# EAGLE design fm_mod_fpga (EAGLE 7.7.0)
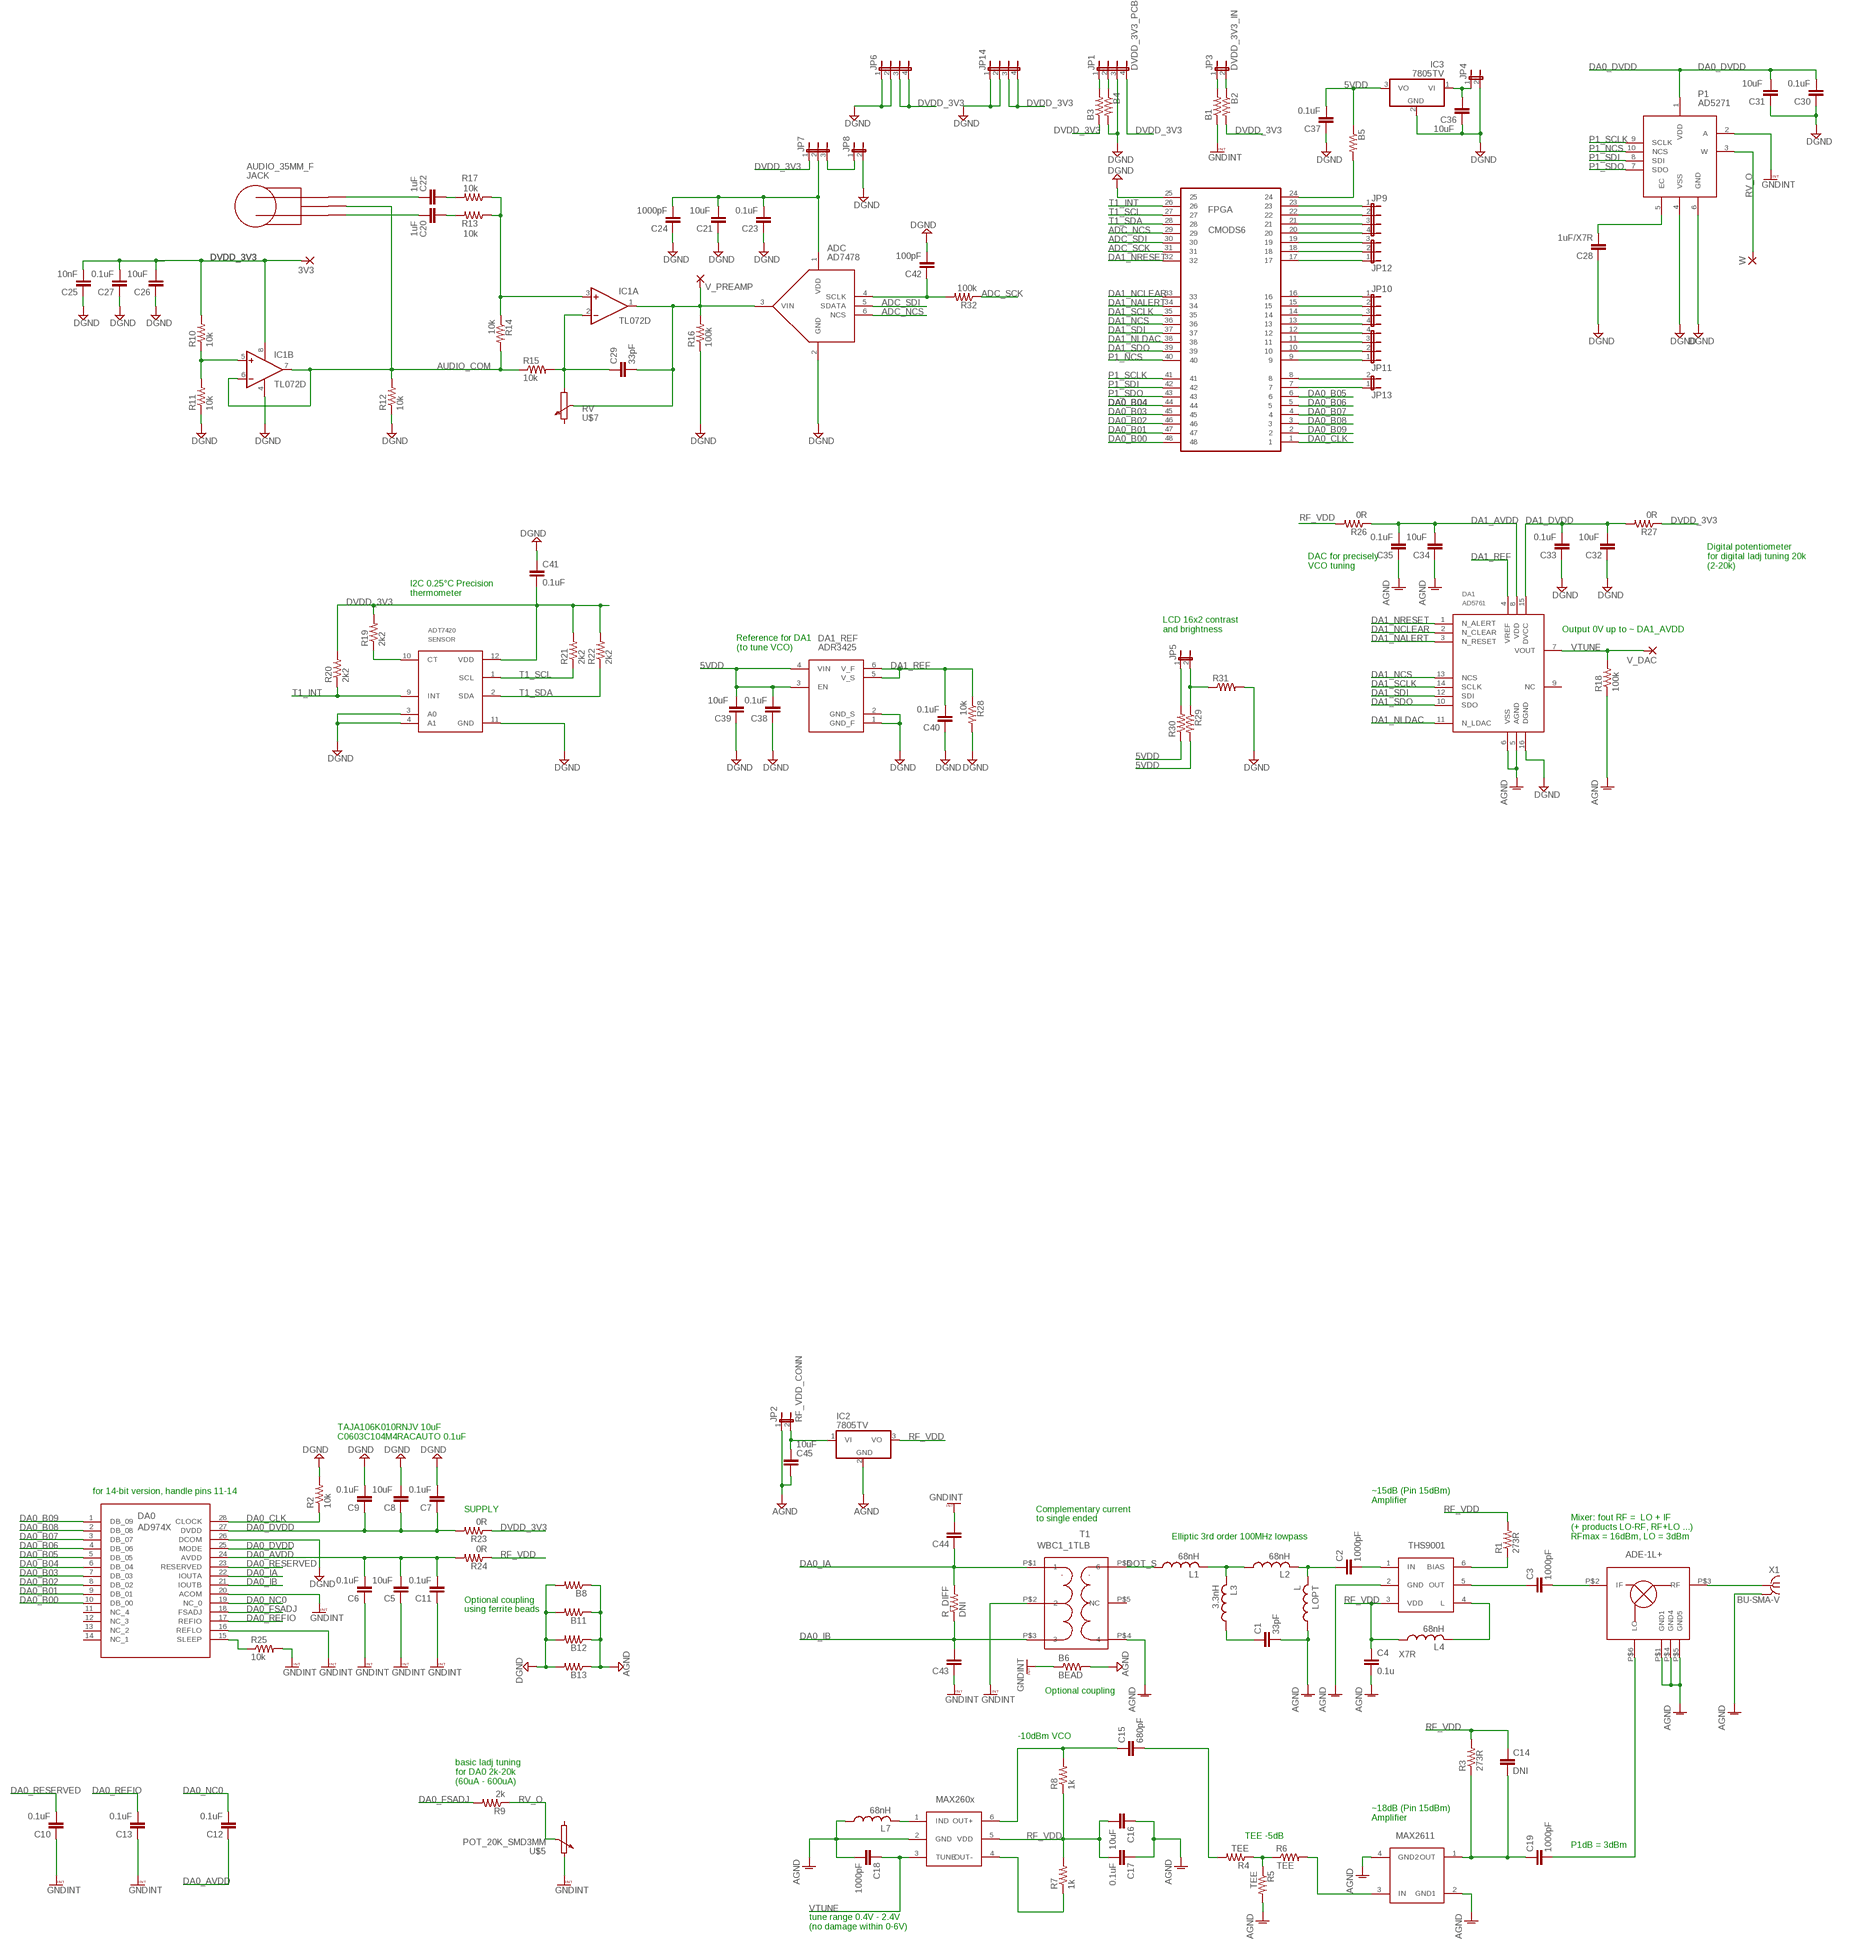
[diagram p0: schematic, sheet 1]

## Parts
3V3  WIREPAD1,6/0,8  [1,6/0,8]
ADC  AD7478  [SOT23-6]
B1  R-US_M0805  [M0805]
B2  R-US_M0805  [M0805]
B3  R-US_M0805  [M0805]
B4  R-US_M0805  [M0805]
B5  R-US_M0805  [M0805]
B6  BEAD  R-US_M0805  [M0805]
B8  R-US_M0805  [M0805]
B11  R-US_M0805  [M0805]
B12  R-US_M0805  [M0805]
B13  R-US_M0805  [M0805]
C1  33pF  C-EUC0603  [C0603]
C2  1000pF  C-EUC0805  [C0805]
C3  1000pF  C-EUC0805  [C0805]
C4  0.1u  C-EUC0805  [C0805]
C5  10uF  C-EUC1206  [C1206]
C6  0.1uF  C-EUC0603  [C0603]
C7  0.1uF  C-EUC0603  [C0603]
C8  10uF  C-EUC1206  [C1206]
C9  0.1uF  C-EUC0603  [C0603]
C10  0.1uF  C-EUC0603  [C0603]
C11  0.1uF  C-EUC0603  [C0603]
C12  0.1uF  C-EUC0603  [C0603]
C13  0.1uF  C-EUC0603  [C0603]
C14  DNI  C-EUC0603  [C0603]
C15  680pF  C-EUC0805  [C0805]
C16  10uF  C-EUC1206  [C1206]
C17  0.1uF  C-EUC0603  [C0603]
C18  1000pF  C-EUC0805  [C0805]
C19  1000pF  C-EUC0805  [C0805]
C20  1uF  C-EUC1206  [C1206]
C21  10uF  C-EUC1206  [C1206]
C22  1uF  C-EUC1206  [C1206]
C23  0.1uF  C-EUC0603  [C0603]
C24  1000pF  C-EUC0805  [C0805]
C25  10nF  C-EUC0805  [C0805]
C26  10uF  C-EUC1206  [C1206]
C27  0.1uF  C-EUC0603  [C0603]
C28  1uF/X7R  C-EUC0805  [C0805]
C29  33pF  C-EUC0603  [C0603]
C30  0.1uF  C-EUC0603  [C0603]
C31  10uF  C-EUC1206  [C1206]
C32  10uF  C-EUC1206  [C1206]
C33  0.1uF  C-EUC0603  [C0603]
C34  10uF  C-EUC1206  [C1206]
C35  0.1uF  C-EUC0603  [C0603]
C36  10uF  C-EUC1206  [C1206]
C37  0.1uF  C-EUC0603  [C0603]
C38  0.1uF  C-EUC0603  [C0603]
C39  10uF  C-EUC1206  [C1206]
C40  0.1uF  C-EUC0603  [C0603]
C41  0.1uF  C-EUC0603  [C0603]
C42  100pF  C-EUC0603  [C0603]
C43  C-EUC0402  [C0402]
C44  C-EUC0402  [C0402]
C45  10uF  C-EUC1206  [C1206]
DA0  AD974X  [TSSOP28]
DA1  AD5761  [TSSOP-16]
DA1_REF  ADR3425  [SOT23-6]
FPGA  CMODS6  [CMODS6_DIP48]
IC1  TL072D  [SO08]
IC2  7805TV  [TO220V]
IC3  7805TV  [TO220V]
JACK  AUDIO_35MM_F  [AUDIO_35MM_F]
JP1  DVDD_3V3_PCB  JP4E  [JP4]
JP2  RF_VDD_CONN  JP1E  [JP1]
JP3  DVDD_3V3_IN  JP1E  [JP1]
JP4  JP1E  [JP1]
JP5  JP1E  [JP1]
JP6  JP4E  [JP4]
JP7  JP2E  [JP2]
JP8  JP1E  [JP1]
JP9  JP4E  [JP4]
JP10  JP4E  [JP4]
JP11  JP4E  [JP4]
JP12  JP2E  [JP2]
JP13  JP1E  [JP1]
JP14  JP4E  [JP4]
L1  68nH  L  [COILCRAFT_0805HP]
L2  68nH  L  [COILCRAFT_0805HP]
L3  3.3nH  L  [COILCRAFT_0805HP]
L4  68nH  L  [COILCRAFT_0805HP]
L7  68nH  L  [COILCRAFT_0805HP]
LOPT  L  [COILCRAFT_0805HP]
P1  AD5271  [MSOP-10]
R1  273R  R-US_R0805  [R0805]
R2  10k  R-US_R0805  [R0805]
R3  273R  R-US_R0805  [R0805]
R4  TEE  R-US_R0805  [R0805]
R5  TEE  R-US_R0805  [R0805]
R6  TEE  R-US_R0805  [R0805]
R7  1k  R-US_R0805  [R0805]
R8  1k  R-US_R0805  [R0805]
R9  2k  R-US_R0805  [R0805]
R10  10k  R-US_R0805  [R0805]
R11  10k  R-US_R0805  [R0805]
R12  10k  R-US_R0805  [R0805]
R13  10k  R-US_R0805  [R0805]
R14  10k  R-US_R0805  [R0805]
R15  10k  R-US_R0805  [R0805]
R16  100k  R-US_R0805  [R0805]
R17  10k  R-US_R0805  [R0805]
R18  100k  R-US_R0805  [R0805]
R19  2k2  R-US_R0805  [R0805]
R20  2k2  R-US_R0805  [R0805]
R21  2k2  R-US_R0805  [R0805]
R22  2k2  R-US_R0805  [R0805]
R23  0R  R-US_R0805  [R0805]
R24  0R  R-US_R0805  [R0805]
R25  10k  R-US_R0805  [R0805]
R26  0R  R-US_R0805  [R0805]
R27  0R  R-US_R0805  [R0805]
R28  10k  R-US_R0805  [R0805]
R29  R-US_R0805  [R0805]
R30  R-US_R0805  [R0805]
R31  R-US_R0805  [R0805]
R32  100k  R-US_R0805  [R0805]
R_DIFF  DNI  R-US_R0603  [R0603]
SENSOR  ADT7420  [LFCSP-16]
T1  WBC1_1TLB  [WBC1_1]
U$2  THS9001  [SOT23-6]
U$3  MAX2611  [SOT143-4]
U$4  MAX260X  [SOT23-6]
U$5  POT_20K_SMD3MM  [POT_3MM_SMD]
U$6  ADE-1L+  [ADE-1L+]
U$7  RV  [RV]
V_DAC  WIREPAD1,6/0,8  [1,6/0,8]
V_PREAMP  WIREPAD1,6/0,8  [1,6/0,8]
W  WIREPAD1,6/0,8  [1,6/0,8]
X1  BU-SMA-V  [BU-SMA-V]

## Nets
5VDD: B5.1 C37.2 C38.2 C39.2 DA1_REF.3(EN) DA1_REF.4(VIN) IC3.3(VO) R29.2 R30.1
100K: ADC.3(VIN) C29.2 IC1.1(A:OUT) R16.2 U$7.2 V_PREAMP.1(P)
ADC_NCS: ADC.6(NCS) FPGA.29
ADC_SCK: FPGA.31 R32.1
ADC_SDI: ADC.5(SDATA) FPGA.30
AGND: B6.2 B8.1 B11.1 B12.1 B13.1 C1.2 C4.2 C16.1 C17.1 C18.2 C34.1 C35.1 C45.2 DA1.5(AGND) DA1.6(VSS) IC2.2(GND) JP2.1 L7.1 LOPT.1 R5.2 R18.1 T1.P$4 U$2.2(GND) U$3.2(GND1) U$3.4(GND2) U$4.2(GND) U$6.P$1(GND1) U$6.P$4(GND4) U$6.P$5(GND5) X1.2 X1.3 X1.4 X1.5
AUDIO_COM: IC1.6(B:-IN) IC1.7(B:OUT) JACK.1 R12.2 R14.2 R15.1
DA0_AVDD: C5.2 C6.2 C11.2 C12.1 DA0.24(AVDD) R24.2
DA0_B00: DA0.10(DB_00) FPGA.48
DA0_B01: DA0.9(DB_01) FPGA.47
DA0_B02: DA0.8(DB_02) FPGA.46
DA0_B03: DA0.7(DB_03) FPGA.45
DA0_B04: DA0.6(DB_04) FPGA.44
DA0_B05: DA0.5(DB_05) FPGA.6
DA0_B06: DA0.4(DB_06) FPGA.5
DA0_B07: DA0.3(DB_07) FPGA.4
DA0_B08: DA0.2(DB_08) FPGA.3
DA0_B09: DA0.1(DB_09) FPGA.2
DA0_CLK: DA0.28(CLOCK) FPGA.1 R2.1
DA0_DVDD: C7.1 C8.1 C9.1 C30.2 C31.2 DA0.25(MODE) DA0.27(DVDD) P1.1(VDD) R23.2
DA0_FSADJ: DA0.18(FSADJ) R9.2
DA0_IA: C44.1 DA0.22(IOUTA) R_DIFF.2 T1.P$1
DA0_IB: C43.2 DA0.21(IOUTB) R_DIFF.1 T1.P$3
DA0_NC0: C12.2 DA0.19(NC_0)
DA0_REFIO: C13.2 DA0.17(REFIO)
DA0_RESERVED: C10.2 DA0.23(RESERVED)
DA0_SLEEP: DA0.15(SLEEP) R25.1
DA1_AVDD: C34.2 C35.2 DA1.8(VDD) R26.1
DA1_DVDD: C32.2 C33.2 DA1.15(DVCC) R27.2
DA1_NALERT: DA1.3(N_RESET) FPGA.34
DA1_NCLEAR: DA1.2(N_CLEAR) FPGA.33
DA1_NCS: DA1.13(NCS) FPGA.36
DA1_NLDAC: DA1.11(N_LDAC) FPGA.38
DA1_NRESET: DA1.1(N_ALERT) FPGA.32
DA1_REF: C40.2 DA1.4(VREF) DA1_REF.5(V_S) DA1_REF.6(V_F) R28.1
DA1_SCLK: DA1.14(SCLK) FPGA.35
DA1_SDI: DA1.12(SDI) FPGA.37
DA1_SDO: DA1.10(SDO) FPGA.39
DGND: ADC.2(GND) B4.2 B8.2 B11.2 B12.2 B13.2 C7.2 C8.2 C9.2 C21.1 C23.1 C24.1 C25.1 C26.1 C27.1 C28.1 C30.1 C31.1 C32.1 C33.1 C36.1 C37.1 C38.1 C39.1 C40.1 C41.1 C42.2 DA0.26(DCOM) DA1.16(DGND) DA1_REF.1(GND_F) DA1_REF.2(GND_S) FPGA.25 IC1.4(P:V-) IC3.2(GND) JP1.3 JP4.2 JP6.1 JP6.2 JP8.2 JP14.1 JP14.2 P1.4(VSS) P1.6(GND) R2.2 R11.1 R12.1 R16.1 R28.2 R31.2 SENSOR.3(A0) SENSOR.4(A1) SENSOR.11(GND)
DOT_S [rf_path]: L1.1 T1.P$6
DVDD_3V3: 3V3.1(P) B2.2 B3.1 C25.2 C26.2 C27.2 C41.2 IC1.8(P:V+) JP1.4 JP6.3 JP6.4 JP7.1 JP14.3 JP14.4 R10.2 R19.2 R20.2 R21.2 R22.2 R23.1 R27.1 SENSOR.12(VDD)
GNDINT: B1.1 B6.1 C5.1 C6.1 C10.1 C11.1 C13.1 C43.1 C44.2 DA0.16(REFLO) DA0.20(ACOM) P1.2(A) R25.2 T1.P$2 U$5.3
N$1 [rf_path]: C15.1 R8.2 U$4.6(OUT+)
N$2 [rf_path]: U$6.P$3(RF) X1.1
N$3: C1.1 L3.1
N$4 [rf_path]: L1.2 L2.1 L3.2
N$5 [rf_path]: C15.2 R4.2
N$6 [rf_path]: C2.1 L2.2 LOPT.2
N$7 [rf_path]: C2.2 U$2.1(IN)
N$8: R1.1 U$2.6(BIAS)
N$9: C3.1 U$2.5(OUT)
N$10: L4.2 U$2.4(L)
N$12: C22.1 JACK.3
N$13 [rf_path]: C14.2 C19.1 R3.1 U$3.1(OUT)
N$14: R7.1 U$4.4(OUT-)
N$17 [rf_path]: R6.2 U$3.3(IN)
N$18 [rf_path]: C19.2 U$6.P$6(LO)
N$19 [rf_path]: R4.1 R5.1 R6.1
N$20: L7.2 U$4.1(IND)
N$21 [rf_path]: C3.2 U$6.P$2(IF)
N$22: B1.2 JP3.1
N$24: ADC.1(VDD) C21.2 C23.2 C24.2 JP7.2
N$25: ADC.4(SCLK) C42.1 R32.2
N$26: JP7.3 JP8.1
N$27: FPGA.8 JP13.2
N$28: B2.1 JP3.2
N$30: B3.2 JP1.1
N$31: B4.1 JP1.2
N$41: IC1.3(A:+IN) R13.1 R14.1 R17.1
N$44: IC1.5(B:+IN) R10.1 R11.2
N$47: C20.2 JACK.2
N$48: C29.1 IC1.2(A:-IN) R15.2 U$7.1
N$49: C22.2 R17.2
N$50: C20.1 R13.2
N$51: FPGA.7 JP13.1
N$52: FPGA.16 JP10.1
N$53: C45.1 IC2.1(VI) JP2.2
N$54: FPGA.15 JP10.2
N$55: FPGA.14 JP10.3
N$56: C28.2 P1.5(EC)
N$57: C36.2 IC3.1(VI) JP4.1
N$58: JP5.1 R30.2
N$59: JP5.2 R29.1 R31.1
N$60: FPGA.13 JP10.4
N$61: R19.1 SENSOR.10(CT)
N$62: FPGA.9 JP11.1
N$63: FPGA.10 JP11.2
N$64: FPGA.23 JP9.1
N$65: FPGA.22 JP9.2
N$66: FPGA.21 JP9.3
N$67: FPGA.20 JP9.4
N$68: FPGA.17 JP12.1
N$69: FPGA.18 JP12.2
N$70: FPGA.19 JP12.3
N$71: FPGA.11 JP11.3
N$72: FPGA.12 JP11.4
N$73: B5.2 FPGA.24
P1_NCS: FPGA.40 P1.10(NCS)
P1_SCLK: FPGA.41 P1.9(SCLK)
P1_SDI: FPGA.42 P1.8(SDI)
P1_SDO: FPGA.43 P1.7(SDO)
RF_VDD: C4.1 C14.1 C16.2 C17.2 IC2.3(VO) L4.1 R1.2 R3.2 R7.2 R8.1 R24.1 R26.2 U$2.3(VDD) U$4.5(VDD)
RV_O: P1.3(W) R9.1 U$5.2 W.1(P)
T1_INT: FPGA.26 R20.1 SENSOR.9(INT)
T1_SCL: FPGA.27 R21.1 SENSOR.1(SCL)
T1_SDA: FPGA.28 R22.1 SENSOR.2(SDA)
VTUNE: C18.1 DA1.7(VOUT) R18.2 U$4.3(TUNE) V_DAC.1(P)
Unconnected: DA0.11(NC_4) DA0.12(NC_3) DA0.13(NC_2) DA0.14(NC_1) DA1.9(NC) T1.P$5(NC) U$5.1 U$7.3

## Notes on the sheet
- DAC for precisely
  VCO tuning
- Digital potentiometer
  for digital Iadj tuning 20k
  (2-20k)
- I2C 0.25°C Precision 
  thermometer
- LCD 16x2 contrast
  and brightness
- Output 0V up to ~ DA1_AVDD
- Reference for DA1
  (to tune VCO)
- TAJA106K010RNJV 10uF
  C0603C104M4RACAUTO 0.1uF
- for 14-bit version, handle pins 11-14
- ~15dB (Pin 15dBm)
  Amplifier
- SUPPLY | Complementary current
- to single ended
- Elliptic 3rd order 100MHz lowpass
- Mixer: fout RF =  LO + IF
  (+ products LO-RF, RF+LO ...)
  RFmax = 16dBm, LO = 3dBm
- Optional coupling
- using ferrite beads
- X7R
- Optional coupling
- -10dBm VCO
- basic Iadj tuning
  for DA0 2k-20k
  (60uA - 600uA)
- ~18dB (Pin 15dBm)
  Amplifier
- TEE -5dB
- P1dB = 3dBm
- tune range 0.4V - 2.4V
  (no damage within 0-6V)

## Library data of the parts
3V3 V_DAC V_PREAMP W = wirepad:WIREPAD: Wire PAD connect wire on PCB
ADC = FM_transmitter:AD7478
B1-B6 B8 B11-B13 R1-R32 = resistor:R-US_: RESISTOR, American symbol
C1-C45 = resistor:C-EU: CAPACITOR, European symbol
DA0 = FM_transmitter:AD974X
DA1 = FM_transmitter:AD5761
DA1_REF = FM_transmitter:ADR3425
FPGA = FM_transmitter:CMODS6
IC1 = linear:TL072: OP AMP
IC2 IC3 = linear:78*: Positive VOLTAGE REGULATOR Source: http://cache.national.com/ds/LM/LM78L05.pdf http://www.fairchildsemi.com/ds/LM/LM7805.pdf
JACK = FM_transmitter:AUDIO_35MM_F
JP1 JP6 JP9-JP11 JP14 = jumper:JP4E: JUMPER
JP2-JP5 JP8 JP13 = jumper:JP1E: JUMPER
JP7 JP12 = jumper:JP2E: JUMPER
L1-L4 L7 LOPT = FM_transmitter:L
P1 = FM_transmitter:AD5271
R_DIFF = rcl:R-US_: RESISTOR, American symbol
SENSOR = FM_transmitter:ADT7420
T1 = FM_transmitter:WBC1_1TLB
U$2 = FM_transmitter:THS9001
U$3 = FM_transmitter:MAX2611
U$4 = FM_transmitter:MAX260X
U$5 = FM_transmitter:POT_20K_SMD3MM
U$6 = FM_transmitter:ADE-1L+
U$7 = FM_transmitter:RV
X1 = con-coax:BU-SMA-V: FEMALE SMA CONNECTOR Radiall distributor RS 112-3794; OC_FARNELL: unknown; OC_NEWARK: unknown

## Net classes
1 rf_power: width 0.61 mm, clearance 0.305 mm
2 rf_path: clearance 1.016 mm

## Board
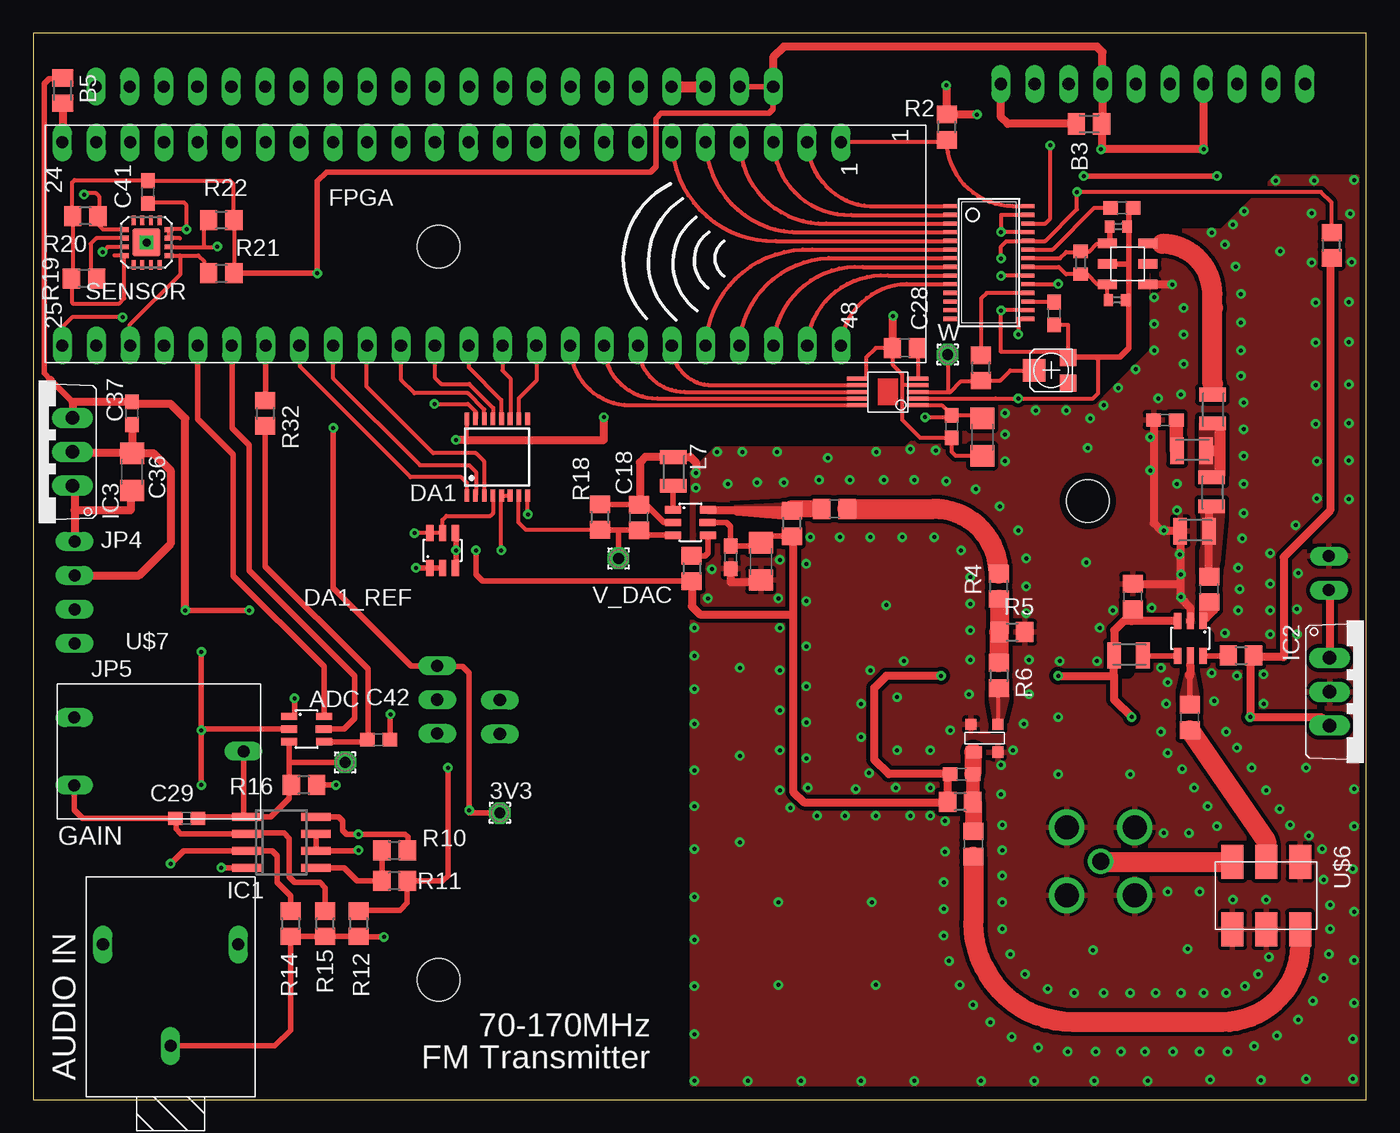
[diagram p1: board, top side]
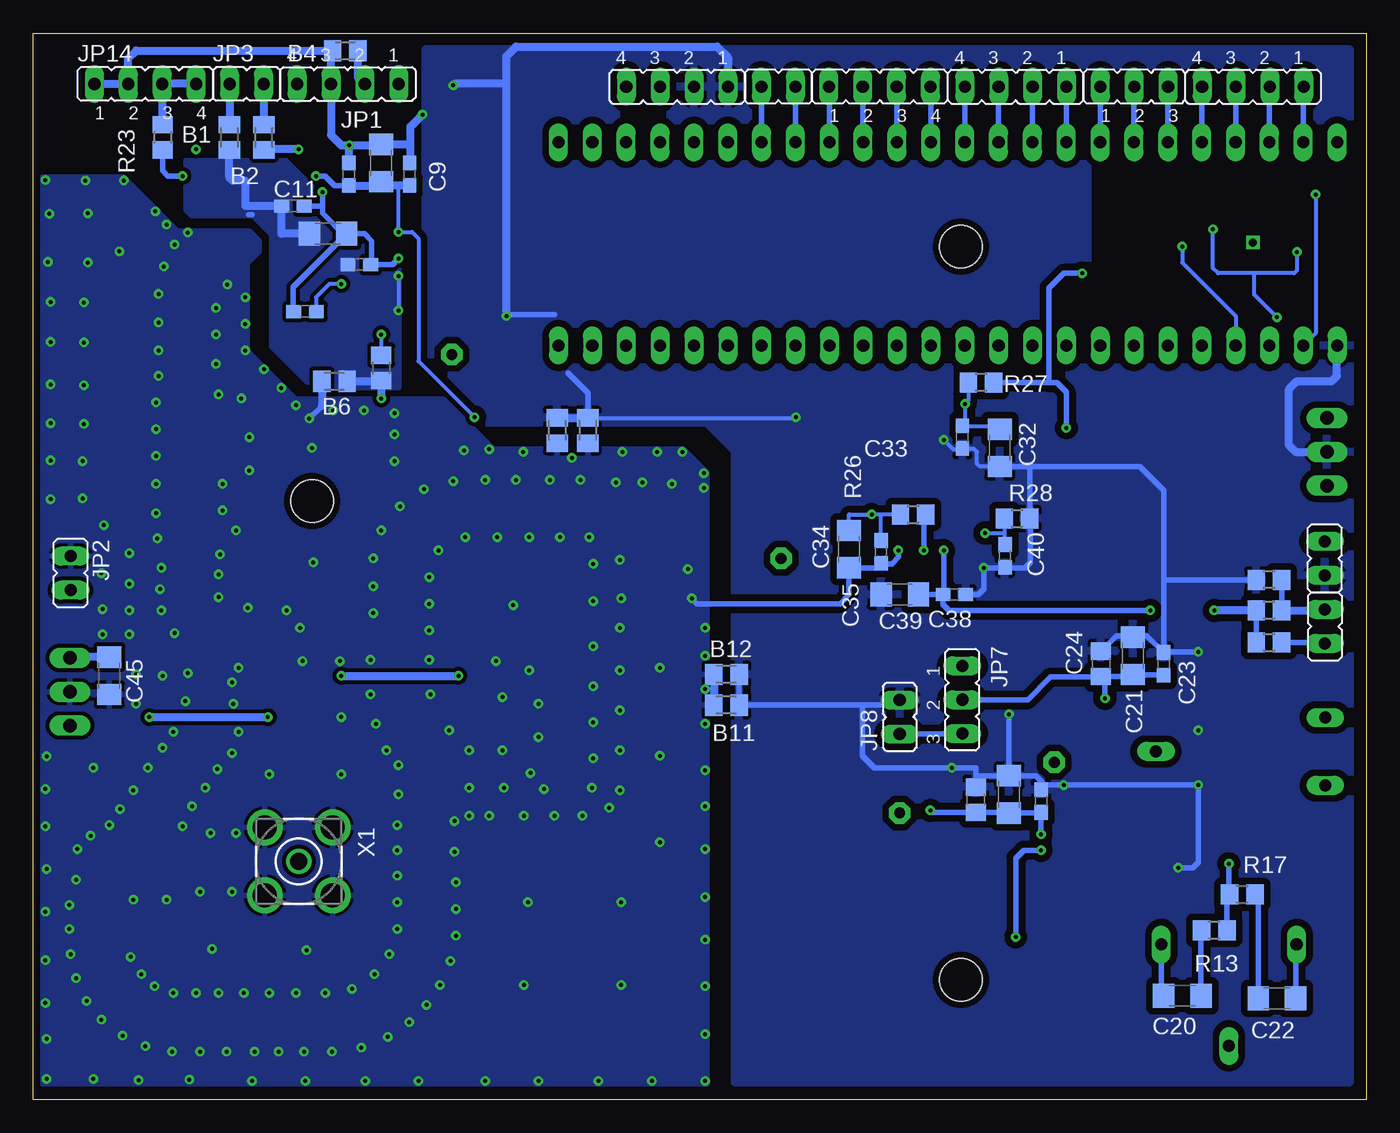
[diagram p2: board, bottom side, seen from below]

Size 100 x 80 mm. Coordinates in mm from the lower left corner, seen from the top.
Outline: 0,0 100,0 100,80 0,80 0,0
Copper layers (1*16): Top 0.035mm / dielectric 1.5mm / Bottom 0.035mm
Design rules "default *": minimum track width 0.3mm, minimum drill 0.3mm, track to track 0.18mm, track to pad 0.18mm, pad to pad 0.18mm, via to via 0.18mm, smd to smd 0.18mm, copper to edge 0.5mm, drill to drill 8mil, minimum pad ring 10mil, minimum via ring 8mil, stop-mask expansion 2mil, vias tented up to drill 0mil, thermal gap 10mil
Holes 3.2 mm at 30.4,64 30.4,9 79.1,44.9
tRestrict: area 85.3,34.4 to 88.1,34.8; 2 lines
bRestrict: area 2,58.7 to 19.9,69.9

### Footprints (pad centres in the part's own frame; a part is rotated, then mirrored left to right if it is on the bottom)
1,6/0,8 = drill 0.813 pad 1.6 octagon: 1 0,0
SOT23-6 = smd 0.55 x 1.2: 1 -0.95,-1.3; 2 0,-1.3; 3 0.95,-1.3; 4 0.95,1.3; 5 0,1.3; 6 -0.95,1.3
M0805 = smd 1.3 x 1.6: 1 -0.95,0; 2 0.95,0
C0603 = smd 1.1 x 1: 1 -0.85,0; 2 0.85,0
C0805 = smd 1.3 x 1.5: 1 -0.95,0; 2 0.95,0
C1206 = smd 1.6 x 1.8: 1 -1.4,0; 2 1.4,0
C0402 = smd 0.7 x 0.9: 1 -0.65,0; 2 0.65,0
TSSOP28 = smd 0.305 x 0.991: 1 -4.225,-2.918; 2 -3.575,-2.918; 3 -2.925,-2.918; 4 -2.275,-2.918; 5 -1.625,-2.918; 6 -0.975,-2.918; 7 -0.325,-2.918; 8 0.325,-2.918; 9 0.975,-2.918; 10 1.625,-2.918; 11 2.275,-2.918; 12 2.925,-2.918; 13 3.575,-2.918; 14 4.225,-2.918; 15 4.225,2.918; 16 3.575,2.918; 17 2.925,2.918; 18 2.275,2.918; 19 1.625,2.918; 20 0.975,2.918; 21 0.325,2.918; 22 -0.325,2.918; 23 -0.975,2.918; 24 -1.625,2.918; 25 -2.275,2.918; 26 -2.925,2.918; 27 -3.575,2.918; 28 -4.225,2.918
TSSOP-16 = smd 0.9 x 0.35: 1 -2.875,2.275; 2 -2.875,1.625; 3 -2.875,0.975; 4 -2.875,0.325; 5 -2.875,-0.325; 6 -2.875,-0.975; 7 -2.875,-1.625; 8 -2.875,-2.275; 9 2.875,-2.275; 10 2.875,-1.625; 11 2.875,-0.975; 12 2.875,-0.325; 13 2.875,0.325; 14 2.875,0.975; 15 2.875,1.625; 16 2.875,2.275
CMODS6_DIP48 = drill 0.914 long: 1 7.62,-25.4; 2 7.62,-22.86; 3 7.62,-20.32; 4 7.62,-17.78; 5 7.62,-15.24; 6 7.62,-12.7; 7 7.62,-10.16; 8 7.62,-7.62; 9 7.62,-5.08; 10 7.62,-2.54; 11 7.62,0; 12 7.62,2.54; 13 7.62,5.08; 14 7.62,7.62; 15 7.62,10.16; 16 7.62,12.7; 17 7.62,15.24; 18 7.62,17.78; 19 7.62,20.32; 20 7.62,22.86; 21 7.62,25.4; 22 7.62,27.94; 23 7.62,30.48; 24 7.62,33.02; 25 -7.62,33.02; 26 -7.62,30.48; 27 -7.62,27.94; 28 -7.62,25.4; 29 -7.62,22.86; 30 -7.62,20.32; 31 -7.62,17.78; 32 -7.62,15.24; 33 -7.62,12.7; 34 -7.62,10.16; 35 -7.62,7.62; 36 -7.62,5.08; 37 -7.62,2.54; 38 -7.62,0; 39 -7.62,-2.54; 40 -7.62,-5.08; 41 -7.62,-7.62; 42 -7.62,-10.16; 43 -7.62,-12.7; 44 -7.62,-15.24; 45 -7.62,-17.78; 46 -7.62,-20.32; 47 -7.62,-22.86; 48 -7.62,-25.4
SO08 = smd 0.6 x 2.2: 1 -1.905,-2.6; 2 -0.635,-2.6; 3 0.635,-2.6; 4 1.905,-2.6; 5 1.905,2.6; 6 0.635,2.6; 7 -0.635,2.6; 8 -1.905,2.6
TO220V = drill 1.016 long: 1 -2.54,-2.54; 2 0,-2.54; 3 2.54,-2.54
AUDIO_35MM_F = drill 0.914 long: 1 5.08,0; 2 -2.54,5.08; 3 -2.54,-5.08
JP4 = drill 0.914 long: 1 -3.81,0; 2 -1.27,0; 3 1.27,0; 4 3.81,0
JP1 = drill 0.914 long: 1 0,-1.27; 2 0,1.27
JP2 = drill 0.914 long: 1 -2.54,0; 2 0,0; 3 2.54,0
COILCRAFT_0805HP = smd 1.02 x 1.98: 1 -0.635,0.32; 2 1.524,0.32
MSOP-10 = smd 0.3 x 1.6: 1 -1,-2.25; 2 -0.5,-2.25; 3 0,-2.25; 4 0.5,-2.25; 5 1,-2.25; 6 1,2.25; 7 0.5,2.25; 8 0,2.25; 9 -0.5,2.25; 10 -1,2.25
R0805 = smd 1.3 x 1.5: 1 -0.95,0; 2 0.95,0
R0603 = smd 1 x 1.1: 1 -0.85,0; 2 0.85,0
LFCSP-16 = smd 0.7 x 0.35: 1 -1.675,0.975; 2 -1.675,0.325; 3 -1.675,-0.325; 4 -1.675,-0.975; 9 1.675,-0.975; 10 1.675,-0.325; 11 1.675,0.325; 12 1.675,0.975 | smd 0.35 x 0.7: 5 -0.975,-1.675; 6 -0.325,-1.675; 7 0.325,-1.675; 8 0.975,-1.675; 13 0.975,1.675; 14 0.325,1.675; 15 -0.325,1.675; 16 -0.975,1.675 | smd 2.1 x 2.1: EXP 0,0
WBC1_1 = smd 0.711 x 1.422: P$1 1.524,1.524; P$2 0,1.524; P$3 -1.524,1.524; P$4 -1.524,-1.524; P$5 0,-1.524; P$6 1.524,-1.524
SOT143-4 = smd 1.194 x 0.838: 1 -0.643,-0.641 | smd 0.838 x 0.838: 2 1.161,-0.641; 3 1.161,1.441; 4 -0.846,1.441
POT_3MM_SMD = smd 1.27 x 1.27: 1 -0.635,0.635; 3 -0.635,-1.27 | smd 1.676 x 1.676: 2 1.905,-0.318
ADE-1L+ = smd 2.54 x 1.65: P$1 -2.54,2.54; P$2 -2.54,0; P$3 -2.54,-2.54; P$4 2.54,-2.54; P$5 2.54,0; P$6 2.54,2.54
RV = drill 0.914 long: 1 1.27,-7.62; 2 13.97,-5.08; 3 1.27,-2.54
BU-SMA-V = drill 1.27: 1 0,0 | drill 1.778: 2 -2.55,2.55; 3 2.55,2.55; 4 2.55,-2.55; 5 -2.55,-2.55

### Placement (x,y rotation side)
3V3  35,21.5 0 top
ADC  20.5,27.8 270 top
B1  85.3,72.2 90 bottom
B2  82.7,72.2 270 bottom
B3  79.2,73.2 180 top
B4  76.6,78.7 180 bottom
B5  2.2,75.7 270 top
B6  77.4,53.9 180 bottom
B8  58.4,50.2 90 bottom
B11  48,29.6 0 bottom
B12  48,31.9 0 bottom
B13  60.7,50.2 90 bottom
C1  84.9,50.99 180 top
C2  88.22,38.28 270 top
C3  86.76,28.67 270 top
C4  82.48,37.75 90 top
C5  77.89,64.95 0 bottom
C6  75.55,62.65 0 bottom
C7  76.33,69.43 90 bottom
C8  73.89,70.27 90 bottom
C9  71.77,69.43 90 bottom
C10  81.67,66.91 180 top
C11  80.53,67.03 0 bottom
C12  79.61,59.12 0 bottom
C13  76.58,58.99 90 top
C14  69.64,24.41 0 top
C15  60.1,44.32 0 top
C16  54.59,40.38 90 top
C17  52.33,40.68 90 top
C18  45.44,43.67 90 top
C19  70.53,19.18 270 top
C20  13.8,7.8 180 bottom
C21  17.5,33.3 270 bottom
C22  6.7,7.6 180 bottom
C23  15.2,32.7 270 bottom
C24  19.9,32.7 270 bottom
C25  29.3,22.5 270 bottom
C26  26.8,22.9 270 bottom
C27  24.4,22.4 270 bottom
C28  65.4,56.4 0 top
C29  11.5,21.1 0 top
C30  68.9,50.5 90 top
C31  71.2,49.7 90 top
C32  27.5,48.9 90 bottom
C33  30.3,49.7 90 bottom
C34  38.8,41.3 90 bottom
C35  36.4,41.1 90 bottom
C36  7.4,47.1 270 top
C37  7.4,51.5 90 top
C38  30.9,37.9 180 bottom
C39  35,37.9 0 bottom
C40  27.1,40.8 90 bottom
C41  8.6,68.1 90 top
C42  25.9,27 0 top
C43  81.3,60 180 top
C44  81.4,65.5 0 top
C45  94.3,31.8 270 bottom
DA0  71.7,62.8 270 top
DA1  34.8,48.2 90 top
DA1_REF  30.7,41.2 0 top
FPGA  35.2,64.2 90 top
IC1  18.6,19.3 270 top
IC2  99.8,30.6 270 top
IC3  0.4,48.6 90 top
JACK  10.3,9.1 270 top
JP1  76.4,76.2 180 bottom
JP2  97.2,39.5 180 bottom
JP3  84,76.2 270 bottom
JP4  3.1,40.6 180 bottom
JP5  3.1,35.5 0 bottom
JP6  51.7,76 180 bottom
JP7  30.3,30 270 bottom
JP8  35,28.7 0 bottom
JP9  8.5,76 180 bottom
JP10  26.3,76 180 bottom
JP11  36.5,76 0 bottom
JP12  17.4,76 0 bottom
JP13  44.1,76 270 bottom
JP14  91.6,76.2 0 bottom
L1  88.14,52.26 270 top
L2  88.09,46.05 270 top
L3  86.45,48.36 0 top
L4  81.72,33 0 top
L7  47.69,47.58 270 top
LOPT  86.68,42.32 0 top
P1  64.1,53.1 90 top
R1  90.6,33.32 0 top
R2  68.53,72.96 90 top
R3  69.54,22.35 180 top
R4  72.43,38.51 90 top
R5  73.43,35.07 0 top
R6  72.43,31.82 270 top
R7  49.4,39.84 270 top
R8  56.9,43.22 90 top
R9  71.1,54.9 90 top
R10  27.1,18.7 0 top
R11  27.1,16.4 180 top
R12  24.4,13.2 270 top
R13  11.4,12.7 180 bottom
R14  19.3,13.2 270 top
R15  21.9,13.2 90 top
R16  20.3,23.6 180 top
R17  9.3,15.4 0 bottom
R18  42.5,43.7 270 top
R19  3.8,61.6 180 top
R20  3.9,66.3 180 top
R21  14.1,62 0 top
R22  14.1,66 0 top
R23  90.3,72.2 270 bottom
R24  97.4,64.1 90 top
R25  73.9,54.9 270 bottom
R26  34,43.9 0 bottom
R27  28.9,53.8 180 bottom
R28  26.2,43.6 0 bottom
R29  7.3,36.7 180 bottom
R30  7.3,34.3 0 bottom
R31  7.3,39 180 bottom
R32  17.4,51.5 270 top
R_DIFF  78.58,62.78 90 top
SENSOR  8.5,64.3 180 top
T1  82.1,62.7 90 top
U$2  86.8,34.6 180 top
U$3  71.2,26.7 0 top
U$4  49.3,43.3 270 top
U$5  77,54.4 180 top
U$6  92.5,15.3 270 top
U$7  1.8,31.2 0 top
V_DAC  43.9,40.6 0 top
V_PREAMP  23.4,25.3 0 top
W  68.6,55.9 0 top
X1  80.09,17.87 270 bottom

### Tracks (layer width: path | path; a pad name or v marks a point on that pad's centre or on a via)
5VDD  (via drill 0.3)
  Top 0.406: 7.55,52.2 C37.2 | 1.3,53.99 2.94,52.35 | 1.3,54 0.8,54.5 0.8,76.2 1.2,76.6 2.15,76.6 | v11.4,36.7 v16.2,36.7 | DA1_REF.4 31.7,42.5 v31.7,41.2 31.7,39.9 DA1_REF.3
  Top 0.61: v11.4,36.7 11.4,51.1 10.3,52.2 7.55,52.2 | C37.2 2.94,52.35 IC3.3 | 1.3,53.99 1.3,54 | 2.15,76.6 B5.1
  Bottom 0.406: R29.2 R30.1 | C38.2 C39.2 | C38.2 31.75,37.15 31.3,36.7 v16.2,36.7 | C38.2 31.7,37.9 v31.7,41.2
  Bottom 0.61: R29.2 v11.4,36.7
100K
  Top 0.406: ADC.3 19.2,25.2 | 19.2,25.2 19.2,23.7 | 19.2,23.7 19.2,22.6 17.8,21.2 IC1.1 | IC1.1 16.1,21.2 | IC1.1 12.46,21.2 C29.2 | U$7.2 15.77,21.43 IC1.1 | R16.2 19.3,23.6 19.2,23.7 | V_PREAMP.1 19.3,25.3 19.2,25.2
ADC_NCS
  Top 0.406: FPGA.29 12.34,51.06 15,48.4 15,39.3 21.8,32.5 ADC.6 | ADC.6
ADC_SCK
  Top 0.406: FPGA.31 17.42,52.47 R32.1
ADC_SDI
  Top 0.406: ADC.5 23.3,27.8 24.1,28.6 24.1,31.8 16.2,39.7 16.2,49.1 14.9,50.4 14.9,56.56 FPGA.30
AGND  (via drill 0.3)
  Top 0.305: DA1.6 DA1.5 35.1,45.33 v35.1,41.2
  Top 0.406: 54.41,38.8 C16.1 | U$4.2 47.3,43.3 46,44.6 45.45,44.6 C18.2 | 45.5,44.69 C18.2 | R18.1 45.41,44.65 C18.2
  Top 0.61: C1.2 84.05,43.25 84.6,42.7 85.99,42.7 LOPT.1 86.05,38.8 | 86.05,38.8 86.05,37.65 86.8,36.9 U$2.2 | C4.2 85.94,38.7 86.05,38.8 | 45.5,44.69 45.5,47.8 45.91,48.21 L7.1 49.29,48.21 49.7,47.8 v49.7,47 | 54.41,38.8 52.33,38.8 C17.1 | T1.P$4 85.45,61.18 v85.45,61.15
  Bottom 0.305: 36.4,40.2 C35.1 36.4,39.9 | 50.8,39.9 v50.9,39.8
  Bottom 0.406: 78.35,52.05 v79.3,51.1 | v50.6,37.6 50.2,37.2 39.5,37.2 38.8,37.9 C34.1 36.4,39.9 | v35.1,41.2 35.1,40.7 35.6,40.2 36.35,40.2 C35.1
  Bottom 0.61: B12.1 B11.1 | B6.2 78.35,52.05
  other vias: 88.4,65.05 90,65.65 84.6,32.4 90.2,62.5 90.6,58.3 90.6,56.2 90.8,48.3 90.8,46.2 90.7,42.1 90.4,39.9 90.4,36.7 89.4,35 94.8,36.8 94.9,39.5 96.3,45.1 96.2,56.8 90.85,66.65 86.3,59.4 86.3,57.4 86.1,52.9 85.8,46.2 86,40.9 83.9,36.9 86.1,37.7 85.8,44.2 83.8,49.7 83.8,47.2 80.3,52.1 75.2,51.7 58.95,46.5 52.1,46.2 61.25,46.5 59.6,48.15 65.8,48.8 63.25,48.6 88.4,32 81,36.7 53.2,48.6 90.3,31.8 85,29.7 85.1,31.3 89.5,27.6 84.6,27.6 74.7,33 74.7,30.4 70.3,33 70.2,30.4 92.3,31.9 95.7,19.8 85.1,26 79.8,32.9 74.5,36.5 74.5,38.5 74.5,40.6 73.9,42.7 72.5,44.5 70.7,45.8 68.5,46.4 66.1,46.5 63.8,46.5 56.3,46.3 58.3,42.2 60.5,42.2 62.8,42.2 65.2,42.2 69.6,41.2 70.3,39.2 70.3,37.2 70.3,35.2 58,40.2 68.8,27.7 67.3,26.2 64.8,26.2 64.8,30.2 74.3,28.2 73.5,26.2 72.6,25.1 67.3,21.3 68.4,18.6 68.3,16.3 56,35.4 56,32.2 56,29.2 56,26.2 56,23.2 65.8,21.3 63.2,21.3 60.9,21.3 58.8,21.3 56.8,21.9 49.6,35.4 97.2,10.9 49.6,30.8 49.6,28.2 49.6,24.7 49.6,22 49.6,12 49.6,8.5 49.6,4.9 49.6,1.4 53.6,1.4 57.6,1.4 62.1,1.4 66.1,1.4 71.1,1.4 75.1,1.4 79.6,1.4 83.6,1.4 88.3,1.5 90.8,52.3 95.9,62.8 58,37.4 58,34 58,31 58,28.3 58,25.6 61.7,23.3 58.1,23.4 67.3,23.4 64.7,23.4 65.3,32.9 62.8,32.2 76.9,28.7 77,32.9 89.4,64.15 90.6,60.45 90.6,54.3 86.3,55.2 84.4,52.6 90.8,50.3 90.5,38.3 90.8,44 93.2,68.95 96.2,59.8 95.9,66.5 96.2,53.6 96.2,50.7 96.3,47.9 84.1,60.2 84.1,58.2 84.1,56.2 82.7,54.8 81.4,53.4 54.3,46.3 80,35.4 86.1,39.4 84.8,42.7 49.6,18.8 49.6,15.2 72.6,22.9 68.4,20.9 62.1,29.7 62.1,27.2 62.7,24.5 49.7,45.9 55.8,48.6 67.6,42.2 99.1,69 96.1,68.95 98.8,66.45 98.9,62.85 98.7,59.85 98.7,56.85 98.7,53.65 98.7,50.75 98.7,47.95 98.7,45.05 92.8,38.7 92.8,41 94.7,43.1 92.8,36.7 92.3,29.7 88.6,29.9 99,25.75 99.1,10.45 55.9,8.6 55.9,14.8 62.9,14.8 63.2,8.6 82.3,24.4 79.1,48.9 79,40.3 55.9,37.6 56,40.5 68.3,14.3 68.3,12.3 68.7,10.4 69.5,8.6 70.5,7.1 71.8,5.8 73.4,4.7 75.4,3.9 77.6,3.6 79.7,3.6 81.6,3.6 83.4,3.6 85.5,3.6 87.5,3.6 89.6,3.6 91.6,4 93.3,4.8 94.9,6 96,7.4 96.8,9.1 99.1,7.25 99,4.55 99,1.55 95.5,1.55 92.1,1.45 72.7,20.6 72.7,18.7 72.7,16.8 72.7,14.8 72.7,12.8 73.3,10.9 74.4,9.4 76.1,8.3 78.1,8 80.3,8 82.3,8 84.2,8 86.1,8 87.8,8 89.5,8 90.9,8.5 91.9,9.4 92.7,10.7 97.3,12.8 97.3,14.6 92.5,15 90,15 96.8,16.5 94.3,20.6 96.7,18.8 93.5,21.8 92.5,23.2 91.4,24.9 90.3,26.4 86.2,24.8 87.1,23.4 88.8,20.5 86.7,20 84.8,20 88.1,22 53,32.4 53,25.8 53,19.3 79.5,11.2 86.6,11.3 76.9,24.4 99.1,23.3 99.1,20.5 99,17.3 99.1,14.1 93.55,63.65 92.8,34.9 94.8,34.9 77.5,51.7 67.7,48.7 72.9,51.5 72.9,49.9 72.9,47.9 51.3,48.6 85.1,15.6 87.5,15.6 64,37.1 95.5,24.9 49.6,33.3
  pour Top (isolate 0.3, rank 3): 99.35,69.2 93.25,69.2 89.2,65.15 83.95,65.15 83.95,56.15 80.35,52.55 69.25,52.55 65.5,48.8 51.25,48.8 49.45,47 49.45,1.2 99.35,1.2
  pour Bottom (isolate 0.3, rank 2): 99.35,69.2 93.25,69.2 89.2,65.15 83.8,65.15 83.05,64.4 83.05,63.65 83.95,62.75 83.95,56.15 80.35,52.55 69.25,52.55 65.5,48.8 51.25,48.8 49.45,47 49.45,1.2 99.3,1.2
AUDIO_COM  (via drill 0.3)
  Top 0.406: IC1.7 IC1.6 24.4,18.66 v24.4,18.7 | v26.3,12.2 24.45,12.2 R12.2 R15.1 R14.2 19.3,5.2 18.12,4.02 JACK.1
  Bottom 0.406: v24.4,18.7 25.7,18.7 26.3,18.1 v26.3,12.2
DA0_AVDD  (via drill 0.3)
  Top 0.305: v72.6,63.1 72.6,64 73,64.4 74.59,64.4 DA0.24 75.92,64.42 78.3,66.8 v78.3,68.1 96.6,68.1 97.4,67.3 R24.2
  Bottom 0.305: 72.75,62.95 v72.6,63.1 | 80.5,59.16 80.5,59.65
  Bottom 0.406: C11.2 78.3,67.03 | 78.3,67.03 78.29,67.03 78.29,66.49 76.6,64.8 | 78.3,67.03 v78.3,68.1 | 80.5,59.65 80.5,60.95 C5.2 75.14,64.95 DA0.24 74.62,62.73 C6.2 73.05,62.65 v72.6,63.1
  Bottom 0.61: 80.5,59.16 C12.1
DA0_B00
  Top 0.305: FPGA.48 arc-90 66,61.17 DA0.10
DA0_B01
  Top 0.305: FPGA.47 arc-90 64.11,61.83 DA0.9
DA0_B02
  Top 0.305: FPGA.46 arc-90 62.22,62.48 DA0.8
DA0_B03
  Top 0.305: FPGA.45 arc-90 60.33,63.12 DA0.7
DA0_B04
  Top 0.305: FPGA.44 arc-90 58.44,63.77 DA0.6
DA0_B05
  Top 0.305: FPGA.6 arc90 55.7,64.42 DA0.5
DA0_B06
  Top 0.305: FPGA.5 arc90 57.59,65.08 DA0.4
DA0_B07
  Top 0.305: FPGA.4 arc90 59.48,65.72 DA0.3
DA0_B08
  Top 0.305: FPGA.3 arc90 61.37,66.38 DA0.2
DA0_B09
  Top 0.305: FPGA.2 arc90 63.26,67.03 DA0.1
DA0_CLK
  Top 0.305: DA0.28 73.52,67.03 arc-90 R2.1 arc-90 68.14,71.62 arc90 67.94,71.82 FPGA.1
DA0_DVDD  (via drill 0.3)
  Top 0.305: DA0.27 72.6,66.38 v72.6,65.1 72.62,65.08 DA0.25 | P1.1 68.15,52.1 C30.2 69.4,51.35 | 69.4,51.35 71.55,51.35 71.7,51.2 71.3,51.2 C31.2 | v66.9,51.2 69.25,51.2 69.4,51.35
  Top 0.406: v78.8,69.3 v88.8,69.3
  Bottom 0.305: 72.6,68.58 v72.6,65.1 71.6,65.1 71.1,64.6 71.1,55.4 v66.9,51.2
  Bottom 0.406: C7.1 77.38,68.58 78.1,69.3 v78.8,69.3 | v88.8,69.3 89.9,69.3 90.3,69.7 R23.2
  Bottom 0.61: C9.1 72.6,68.58 73.61,68.58 C8.1 74.18,68.58 C7.1
DA0_FSADJ
  Top 0.305: DA0.18 71.53,60.52 71.1,60.1 R9.2
DA0_IA
  Top 0.305: DA0.22 77.03,63.12 77.5,63.6 78.55,63.6 R_DIFF.2 79.23,63.63 79.8,64.2 80.55,64.2 T1.P$1
  Top 0.406: T1.P$1 80.75,64.22 C44.1
DA0_IB
  Top 0.305: DA0.21 76.92,62.48 77.47,61.93 R_DIFF.1 79.07,61.93 79.8,61.2 80.55,61.2 T1.P$3 80.58,60 C43.2
DA0_NC0  (via drill 0.3)
  Top 0.305: DA0.19 76.9,61.17 v76.9,61.2
  Bottom 0.305: v76.9,61.2 77.8,61.2 78.8,60.2 78.8,59.16 C12.2
DA0_REFIO
  Top 0.305: DA0.17 76.55,59.88 C13.2
DA0_RESERVED
  Top 0.305: DA0.23 76.47,63.77 79.6,66.9 C10.2
DA0_SLEEP  (via drill 0.3)
  Top 0.305: DA0.15 73.9,58.58 v73.9,57.4
  Bottom 0.305: v73.9,57.4 R25.1
DA1_AVDD  (via drill 0.3)
  Top 0.305: v37.1,43.9 37.08,43.9 DA1.8
  Bottom 0.305: C34.2 38.8,43.9 v37.1,43.9 36.4,43.9 | R26.1 36.4,43.9 | C35.2 36.4,43.9
DA1_DVDD  (via drill 0.3)
  Top 0.305: v30.1,52.2 32.6,52.2 33.2,51.6 33.2,51.1 DA1.15
  Bottom 0.305: C32.2 27.75,50.55 C33.2 30.1,50.75 v30.1,52.2 29.85,52.45 R27.2
DA1_NALERT
  Top 0.305: DA1.3 33.8,45.35 33.8,47.9 33.2,48.5 30,48.5 25,53.5 25,56.54 FPGA.34
DA1_NCLEAR
  Top 0.305: DA1.2 33.2,45.35 33.2,47.1 32.7,47.6 29,47.6 22.5,54.1 FPGA.33
DA1_NCS
  Top 0.305: FPGA.36 30.12,54.18 30.6,53.7 32.7,53.7 34.5,51.9 34.5,51.1 DA1.13
DA1_NLDAC
  Top 0.305: FPGA.38 35.2,54.7 35.8,54.1 35.8,51.1 DA1.11
DA1_NRESET
  Top 0.305: DA1.1 32.52,46.27 32.1,46.7 28.3,46.7 20,55 20,56.54 FPGA.32
DA1_REF  (via drill 0.3)
  Top 0.305: DA1_REF.6 DA1_REF.5 30.7,43.5 31,43.8 34.3,43.8 34.48,43.98 DA1.4 | DA1_REF.6 | DA1_REF.6 v28.6,42.5 | v28.6,42.5
  Bottom 0.305: R28.1 27.15,42.5 | 27.15,42.5 27.15,41.7 C40.2 | v28.6,42.5 27.15,42.5
DA1_SCLK
  Top 0.305: DA1.14 33.83,51.77 32.6,53 28.6,53 27.6,54 27.6,56.56 FPGA.35
DA1_SDI
  Top 0.305: FPGA.37 32.66,54.94 35.1,52.5 35.1,51.1 DA1.12
DA1_SDO
  Top 0.305: DA1.10 36.42,52.62 37.74,53.94 FPGA.39
DGND  (via drill 0.3)
  Top 0.305: P1.6 62.5,54.1 62.5,55.7 63.2,56.4 C28.1 64.5,56.35 64.5,55.1 65.2,54.4 65.2,53.6 | DA0.26 75.92,65.72 76.3,66.1 v76.3,71.6 | P1.4 65.2,53.6 | DA1.16 32.5,51.08 32.5,49.5 | 10.2,65.3 SENSOR.4 | SENSOR.11 5.58,63.98 v5.2,63.6 | C41.1 8.65,67.3 11.3,67.3 11.5,67.1 v11.5,65.3 10.18,65.3 SENSOR.4 | v6.7,58.7 2.9,58.7 2.2,58 2.2,56.6 FPGA.25 | 11,64.62 SENSOR.3 SENSOR.4 | C31.1 69.2,48.3 68.9,48.6 C30.1 66.55,49.65 65.2,51 65.2,53.6
  Top 0.406: ADC.2 12.6,27.8 | R12.1 24.45,14.2 27.5,14.2 28.05,14.75 R11.1 30.7,16.4 31.1,16.8 v31.1,24.9 | v12.6,33.6 12.6,27.8 | IC1.4 v14.1,17.39 v14.1,17.4 | 12.6,27.8 v12.6,27.7 v12.6,23.6 | C42.2 26.75,28.85 v26.8,28.9 | DA1_REF.2 DA1_REF.1 v28.7,39.9 | v28.7,39.9 | R16.1 v22.7,23.6
  Top 0.61: v70.8,73.9 68.55,73.9 R2.2 68.5,73.94 v68.5,76.1 | C28.1 64.5,56.4 v64.5,58.8 | v31.7,49.5 32.5,49.5 42.8,49.5 v42.8,51.2 | JP4.2 7.93,39.33 10.3,41.7 10.3,47.2 9,48.5 C36.1 | C37.1 C36.1 | C36.1 2.94,48.5 IC3.2
  Top 0.813: JP6.1 JP6.2
  Bottom 0.305: v31.7,49.5 31,48.8 30.35,48.8 C33.1 30.25,48.8 29.4,48.8 29.2,48.6 29.2,47.7 29,47.5 C32.1 | v5.2,63.6 5.2,62.2 5.4,62 8.4,62 | 8.4,62 11.1,62 11.5,62.4 v11.5,65.3 | 8.4,62 8.4,60.4 v6.7,58.7 | B8.2 42.75,51.15 | 25.2,43.55 R28.2
  Bottom 0.406: v12.6,33.6 15.15,33.6 C23.1 | 26.8,24.4 C26.1 | v14.1,17.4 13,17.4 12.6,17.8 v12.6,23.6 v22.7,23.6 24.05,23.6 24.3,23.35 | C25.1 29.3,24.3 | 29.3,24.3 29.3,24.9 v31.1,24.9 36.9,24.9 37.8,25.8 37.8,29.5 37.7,29.6 | v26.8,28.9 C26.1 | B8.2 58.4,53 59.9,54.5 | 60.9,58.9 64.4,58.9 v64.5,58.8 | R31.2 15.1,39 15.2,38.9 | C23.1 16.45,34.8 17.4,34.8 C21.1 17.6,34.8 18.75,34.8 C24.1 | 24.3,23.35 C27.1 | 24.3,23.35 24.3,23.8 24.8,24.3 C26.1 | C26.1 29.3,24.3 | C23.1 15.2,38.9 | 15.2,38.9 15.2,45.7 17,47.5 C32.1 25.25,47.5 R28.2 | 37.7,29.6 B11.2 B12.2 | 37.7,29.6 35.37,29.6 JP8.2 | 25.2,43.55 25.2,40.3 25.6,39.9 27.05,39.9 C40.1 27.15,39.9 v28.7,39.9 28.7,38.3 29.1,37.9 C38.1
  Bottom 0.61: v76.3,71.6 76.9,71.6 77.67,72.37 JP1.3 77.67,78.58 B4.2 92.3,78.7 92.87,78.13 JP14.2 JP14.1 | v76.3,71.6 73.96,71.6 C8.2 71.77,71.67 71.7,71.6 | C7.2 76.33,71.58 v76.3,71.6 | C9.2 71.7,70.35 71.7,71.6 | 71.7,71.6 71.7,73 v70.8,73.9 | 64.5,76.2 68.4,76.2 v68.5,76.1 | v64.5,58.8 64.5,76.2 | 64.5,76.2 64.5,78.3 63.8,79 48.7,79 47.9,78.2 JP6.1 | IC3.2 5.3,48.6 5.8,49.1 5.8,53.3 5.2,53.9 2.6,53.9 2.2,54.3 2.2,56.56 FPGA.25 | B13.2 B8.2
  pour Bottom (isolate 0.5): 70.6,78.8 70.6,51.9 69.5,50.8 49.5,50.8 47.4,48.7 47.4,1.3 1.2,1.3 1.2,78.8
DOT_S
  Top 0.305: T1.P$6 84.7,64.22 84.7,64.2
  Top 0.61: L1.1 88.5,52.9 88.5,53.7
  Top 1.5: 88.46,59.39 88.5,59.39 | 88.5,53.7 88.46,53.7 88.46,59.39 | 88.46,59.39 88.46,60.44 arc90 84.7,64.2
DVDD_3V3  (via drill 0.3)
  Top 0.305: R21.2 R22.2 15,66.05 15,68.7 14.75,68.95 C41.2 8.55,69 3.1,69 2.9,68.8 2.9,66.35 R20.2 2.95,61.7 R19.2 2.9,61.55 2.9,59.8 3,59.7 6.4,59.7 6.83,60.12 SENSOR.12 6.1,63.33
  Top 0.406: v22.5,50.4 22.5,38.4 28.36,32.54 JP7.1 30.34,32.5 32.2,32.5 32.7,32 v32.7,21.7 32.7,21.5 3V3.1 | R21.2 v21.3,62 21.3,68.9 22,69.6 46.3,69.6 46.7,70 46.7,73.6 47.1,74 55.2,74 55.5,74.3 JP6.4 | R10.2 28.1,18.75 28.1,19.7 27.9,19.9 v24.4,19.9 23.5,19.9 23.2,20.2 23.2,20.9 22.89,21.2 IC1.8 | JP6.4 JP6.3
  Top 0.61: JP14.4 v87.79,71.31 v87.8,71.3 v80.1,71.3 80.15,71.35 B3.1 80.21,73.26 JP1.4 80.21,78.59 79.8,79 56.3,79 55.5,78.2 JP6.4
  Bottom 0.305: 23.8,54 24,53.8
  Bottom 0.406: R27.1 24,53.8 23.2,53.8 22.5,53.1 v22.5,50.4 | v24.4,19.9 C27.2 24.45,21.5 C26.2 26.85,21.55 C25.2 32.55,21.55 v32.7,21.7 | v21.3,62 22.7,62 23.8,60.9 23.8,54
  Bottom 0.61: 90.25,73.2 R23.1 90.33,73.18 JP14.3 JP14.4 | 82.75,71.3 B2.2 82.65,71.3 v80.1,71.3
GNDINT  (via drill 0.3)
  Top 0.305: DA0.16 72.62,59.23 v72.6,59.2 72.6,56.1 77.2,56.1 77.2,55.7 77.6,55.7 U$5.3 77.64,58.14 C13.1 | DA0.20 72.6,61.83 v72.6,61.8 | P1.2 72.2,52.6 v73.9,52.6 79.5,52.6 79.9,53 79.9,55.5 79.7,55.7 | 82.2,65.2 82.2,65.3 | C43.1 82.2,60
  Top 0.406: 82.2,62.7 82.2,65.3 82.2,65.5 | 82.2,65.5 82.2,67.03 82.5,67.03 82.5,66.91 C10.1 | T1.P$2 82.2,62.7 | 82.2,62.7 82.2,60 82.2,56.4 81.5,55.7 79.7,55.7 77.67,55.7 U$5.3 | C44.2 82.2,65.5
  Bottom 0.305: v72.6,61.8 v72.6,59.2
  Bottom 0.406: 83.6,66.41 83.85,66.41
  Bottom 0.61: B1.1 85.3,69.2 85.03,68.94 84.1,68.94 84.1,67.03 C11.1 81.38,64.95 C5.1 | B6.1 73.9,53.9 R25.2 v73.9,52.6
  pour Bottom (isolate 0.3, no thermals): 88.6,70.5 88.6,66.7 88.2,66.3 83.5,66.3 83.5,66.2 82.2,64.9 82.2,56.5 79.1,53.4 72.5,53.4 72.5,63.4 73.2,64.1 74.6,64.1 81,70.5
N$1
  Top 0.406: 56.9,44.25 R8.2
  Top 0.61: U$4.6 56.9,44.25 | 52.8,44.1 56.3,43.8 56.3,44.17 R8.2
  Top 1.27: C15.1 56.9,44.32 R8.2
  pour Top (no thermals): 50.3,44.4 56.3,44.7 56.3,43.6 50.3,44.2
N$2
  Top 1.5: X1.1 arc90 80.11,17.84 U$6.P$3
N$3
  Top 0.406: 85.75,48.74 L3.1
  Top 1.016: C1.1 85.75,48.74
N$4
  Top 0.813: L1.2 89,50.74 89,48.67 | 89,48.67 89,46.8 88.41,46.8 L2.1 | L3.2 89,48.67
  pour Top (no thermals): 87.8,50.6 87.8,47 89,47 89,50.6
N$5
  Top 1.5: R4.2 arc90 67.56,44.32 C15.2
N$6
  Top 0.61: C2.1 88.21,39.23 LOPT.2 88.21,44.52 L2.2
  Top 0.813: L2.2 89,44.52
  pour Top (no thermals): 87.6,44.2 87.6,39.8 88.9,39.8 89.3,44.2
N$7
  Top 0.305: 87.9,36.2 87.75,36.2 U$2.1
  Top 0.61: C2.2 87.75,37.33 U$2.1
  Top 0.813: 88.5,37 88.5,36.8 87.9,36.2
  pour Top (no thermals): 87.6,36.8 87.6,35.9 87.9,35.9
N$8
  Top 0.406: U$2.6 89.63,33.3 R1.1
N$9
  Top 0.305: U$2.5 86.76,33.3
  Top 0.406: 86.8,32.6 86.76,32.6 C3.1
  Top 0.5: U$2.5 86.8,32.6
  Top 0.61: C3.1 86.8,29.62 | 86.8,31.9 86.7,31.8 | 86.76,31.76 86.8,31.8 86.8,31.9 | 86.8,31.9 86.7,31.9 | 86.8,32.6 86.8,31.9
  pour Top (isolate 0.7, no thermals): 86.9,32.8 86.7,32.8 86.1,30.2 87.4,30.2
N$10
  Top 0.406: U$2.4 83.24,33.3 L4.2
N$12
  Bottom 0.406: 5.22,7.6 C22.1 5.3,11.64 JACK.3
N$13
  Top 1.016: C14.2 R3.1
  Top 1.27: U$3.1 70.49,26.06 C14.2 | R3.1 70.53,22.35 C19.1
N$14
  Top 0.406: U$4.4 50.6,41 50.4,40.8 R7.1
N$17
  Top 0.305: 72.36,30.86 U$3.3
  Top 0.406: R6.2 72.36,30.86
  pour Top (no thermals): 72.1,28.6 71.8,30.3 73.1,30.3 72.7,28.6
N$18
  Top 1.5: C19.2 70.53,13.27 arc90 78,5.8 89.2,5.8 arc90 95.04,11.64 U$6.P$6
N$19
  Top 1.422: R4.1 72.48,37.55 R5.1 72.43,35.07 R6.1
N$20
  Top 0.406: U$4.1 48,46.04 L7.2
N$21
  Top 1.5: C3.2 92.5,19.4 U$6.P$2
N$22
  Bottom 0.61: JP3.1 85.27,73.18 B1.2
N$24  (via drill 0.3)
  Top 0.406: ADC.1 19.6,28.75 v19.6,30.1
  Bottom 0.406: C23.2 17,31.85 | 17,31.85 17.5,31.85 C21.2 | C24.2 17,31.75 17,31.85 | C24.2 19.6,31.75 v19.6,30.1 | JP7.2 25.4,30 23.7,31.7 19.95,31.7 C24.2
N$25
  Top 0.406: ADC.4 25.05,26.85 C42.1 25.1,27.05 25.1,32.3 17.4,40 R32.2
N$26
  Top 0.406: 30.3,27.43 JP7.3
  Bottom 0.406: JP8.1 30.3,27.43 JP7.3
N$27
  Bottom 0.406: JP13.2 FPGA.8
N$28
  Bottom 0.61: JP3.2 82.73,73.18 B2.1
N$30
  Top 0.61: B3.2 73.1,73.2 72.6,73.7 JP1.1
N$31
  Bottom 0.61: JP1.2 75.65,76.72 B4.1
N$41  (via drill 0.3)
  Top 0.406: R14.1 19.3,15.3 18.3,16.3 18.3,18.3 17.93,18.66 IC1.3 11.27,18.66 v10.3,17.7
  Bottom 0.406: v10.3,17.7 10.3,15.45 R17.1 10.45,15.4 R13.1
N$44
  Top 0.406: IC1.5 23.3,17.4 24.3,16.4 R11.2 R10.1
N$47
  Bottom 0.406: C20.2 15.38,7.8 JACK.2
N$48
  Top 0.406: R15.2 21.9,15.9 21.5,16.3 19.6,16.3 19.2,16.7 19.2,19.6 18.8,20 16.07,20 IC1.2 11.06,19.93 10.7,20.3 10.7,21.05 C29.1 3.7,21.1 3.07,21.73 U$7.1
N$49
  Bottom 0.406: R17.2 8.1,15.4 C22.2
N$50
  Bottom 0.406: R13.2 12.4,12.7 C20.1
N$51
  Bottom 0.406: JP13.1 FPGA.7
N$52
  Bottom 0.406: JP10.1 FPGA.16
N$53
  Top 0.61: JP2.2 97.26,38.23 IC2.1
  Bottom 0.61: C45.1 97.26,33.2 IC2.1
N$54
  Bottom 0.406: JP10.2 FPGA.15
N$55
  Bottom 0.406: JP10.3 FPGA.14
N$56
  Top 0.305: C28.2 P1.5
N$57
  Top 0.61: IC3.1 3.1,46.06 3.1,44.2 | 3.1,44.2 JP4.1 | C36.2 7.3,45.7 7.3,44.2 3.1,44.2
N$58
  Bottom 0.406: R30.2 3.17,34.3 JP5.1
N$59
  Bottom 0.406: 3.17,36.7 JP5.2 | R31.1 R29.1
  Bottom 0.61: R29.1 3.17,36.7
N$60
  Bottom 0.406: JP10.4 FPGA.13
N$61
  Top 0.305: SENSOR.10 4.72,64.62 4.3,64.2 4.3,62.05 R19.1
N$62
  Bottom 0.406: JP11.1 40.28,76 FPGA.9
N$63
  Bottom 0.406: JP11.2 37.74,76 FPGA.10
N$64
  Bottom 0.406: JP9.1 4.72,76 FPGA.23
N$65
  Bottom 0.406: JP9.2 7.26,76 FPGA.22
N$66
  Bottom 0.406: JP9.3 9.8,76 FPGA.21
N$67
  Bottom 0.406: JP9.4 12.34,76 FPGA.20
N$68
  Bottom 0.406: JP12.1 19.96,76 FPGA.17
N$69
  Bottom 0.406: JP12.2 17.42,76 FPGA.18
N$70
  Bottom 0.406: JP12.3 14.88,76 FPGA.19
N$71
  Bottom 0.406: JP11.3 35.2,76 FPGA.11
N$72
  Bottom 0.406: JP11.4 32.66,76 FPGA.12
N$73
  Top 0.61: B5.2 2.2,71.84 FPGA.24
N$75  (via drill 0.6)
  other vias: 8.5,64.3
P1_NCS
  Top 0.305: P1.10 45.3,52.1 45.06,52.1 44.76,52.1 arc-90 FPGA.40
P1_SCLK
  Top 0.305: P1.9 46.8,52.6 arc-90 FPGA.41
P1_SDI
  Top 0.305: P1.8 48.84,53.1 arc-90 FPGA.42
P1_SDO
  Top 0.305: P1.7 50.88,53.6 arc-90 FPGA.43
RF_VDD  (via drill 0.3)
  Top 0.406: R8.1 54.59,42.27 C16.2 54.59,41.53 C17.2 52.3,41.56 52.3,43 52,43.3 U$4.5 | R7.2 33.7,38.9 33.2,39.4 v33.2,41.2
  Top 0.61: U$2.3 82.4,35.9 | 82.4,35.9 81.8,35.9 81.1,35.2 81.1,33.34 L4.1 | L4.1 81.1,33.32 | C4.1 82.48,35.98 82.4,35.9 | R3.2 68.59,24.41 C14.1 64.19,24.41 63.1,25.5 63.1,30.9 64,31.8 v68.1,31.8 | R8.1 57,42.27 57,36.4 | 57,36.4 57,23.1 57.8,22.3 68.59,22.3 R3.2 | 68.54,22.3 R3.2 | R7.2 49.4,37 50,36.4 57,36.4 | 81.08,31.8 L4.1 | v76.9,31.8 81.08,31.8 | R24.1 97.3,63.15 97.3,44.2 93.8,40.7 93.8,33.2 91.67,33.2 R1.2 91.3,33.32 v91.3,28.7 96.62,28.7 IC2.3 | 81.08,31.8 81.08,30.02 v82.4,28.7
  Bottom 0.406: R26.2 33.2,43.9 v33.2,41.2
  Bottom 0.61: v91.3,28.7 v82.4,28.7 | v76.9,31.8 v68.1,31.8
RV_O
  Top 0.305: P1.3 68.6,53.1 | 68.6,53.1 68.8,53.1 69.6,53.9 71.05,53.9 R9.1 72.55,53.95 73.3,54.7 75.08,54.7 U$5.2 | W.1 68.6,53.1
T1_INT  (via drill 0.3)
  Top 0.305: v3.8,67.9 3.9,68 4.7,68 4.92,67.78 4.92,66.38 R20.1 4.8,66.25 4.8,65.7 5.22,65.28 SENSOR.9
  Bottom 0.305: v3.8,67.9 3.8,57.5 FPGA.26
T1_SCL
  Top 0.305: SENSOR.1 11,63.33 | 11,63.33 12.38,63.33 12.8,62.9 12.8,62.35 R21.1 | 11,63.33 11,61.9 7.2,58.1 7.2,56.64 FPGA.27
T1_SDA  (via drill 0.3)
  Top 0.305: SENSOR.2 12.9,63.98 | 12.9,63.98 13.8,63.98 v13.8,64 | R22.1 12.8,65.65 12.8,64.08 12.9,63.98
  Bottom 0.305: v13.8,64 13.8,62.8 9.8,58.8 FPGA.28
VTUNE
  Top 0.305: R18.2 36.95,42.75 36.4,43.3 36.4,45.3 DA1.7
  Top 0.406: U$4.3 45.8,42.35 C18.1 43.9,42.72 | 43.9,42.72 42.53,42.72 R18.2 | V_DAC.1 43.9,42.72

### Text on the board
tNames: GAIN | AUDIO IN | 70-170MHz | FM Transmitter
dxf: GNDINT | DGND | AGND